# Altium schematic sheet supply.SchDoc
size A4; SheetNumber: 21; SheetTotal: 31
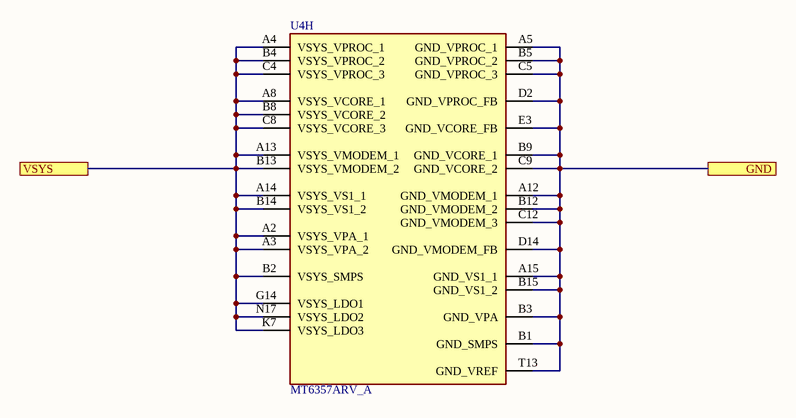
[diagram p0: supply.SchDoc]

## Parts
U4  MT6357ARV_A  [BGA209C40P17X16_700X660X100]  (part H of 8)

## Ports
GND (see Power[4000,2800]), VSYS (see Power[4000,3200])

## Nets
GND: U4.A5(GND_VPROC_1) U4.A12(GND_VMODEM_1) U4.A15(GND_VS1_1) U4.B1(GND_SMPS) U4.B3(GND_VPA) U4.B5(GND_VPROC_2) U4.B9(GND_VCORE_1) U4.B12(GND_VMODEM_2) U4.B15(GND_VS1_2) U4.C5(GND_VPROC_3) U4.C9(GND_VCORE_2) U4.C12(GND_VMODEM_3) U4.D2(GND_VPROC_FB) U4.D14(GND_VMODEM_FB) U4.E3(GND_VCORE_FB) U4.T13(GND_VREF) ; port GND
VSYS: U4.A2(VSYS_VPA_1) U4.A3(VSYS_VPA_2) U4.A4(VSYS_VPROC_1) U4.A8(VSYS_VCORE_1) U4.A13(VSYS_VMODEM_1) U4.A14(VSYS_VS1_1) U4.B2(VSYS_SMPS) U4.B4(VSYS_VPROC_2) U4.B8(VSYS_VCORE_2) U4.B13(VSYS_VMODEM_2) U4.B14(VSYS_VS1_2) U4.C4(VSYS_VPROC_3) U4.C8(VSYS_VCORE_3) U4.G14(VSYS_LDO1) U4.K7(VSYS_LDO3) U4.N17(VSYS_LDO2) ; port VSYS

## Library data of the parts
U4 = MT6357ARV_A: Integrated Circuit; Manufacturer_Name: Mediatek; Manufacturer_Part_Number: MT6357ARV/A; Datasheet Link: https://mediatek-marketing.files.svdcdn.com/production/documents/Genio-PMICs/MTK_MT6357_Product-Brief_v1.0.pdf?dm=1696608680; Height: 1mm; Mouser Part Number: 840-MT6357ARV/A; Mouser Price/Stock: https://www.mouser.co.uk/ProductDetail/MediaTek/MT6357ARV-A?qs=Jm2GQyTW%2Fbim3iWdQ0ZJPw%3D%3D